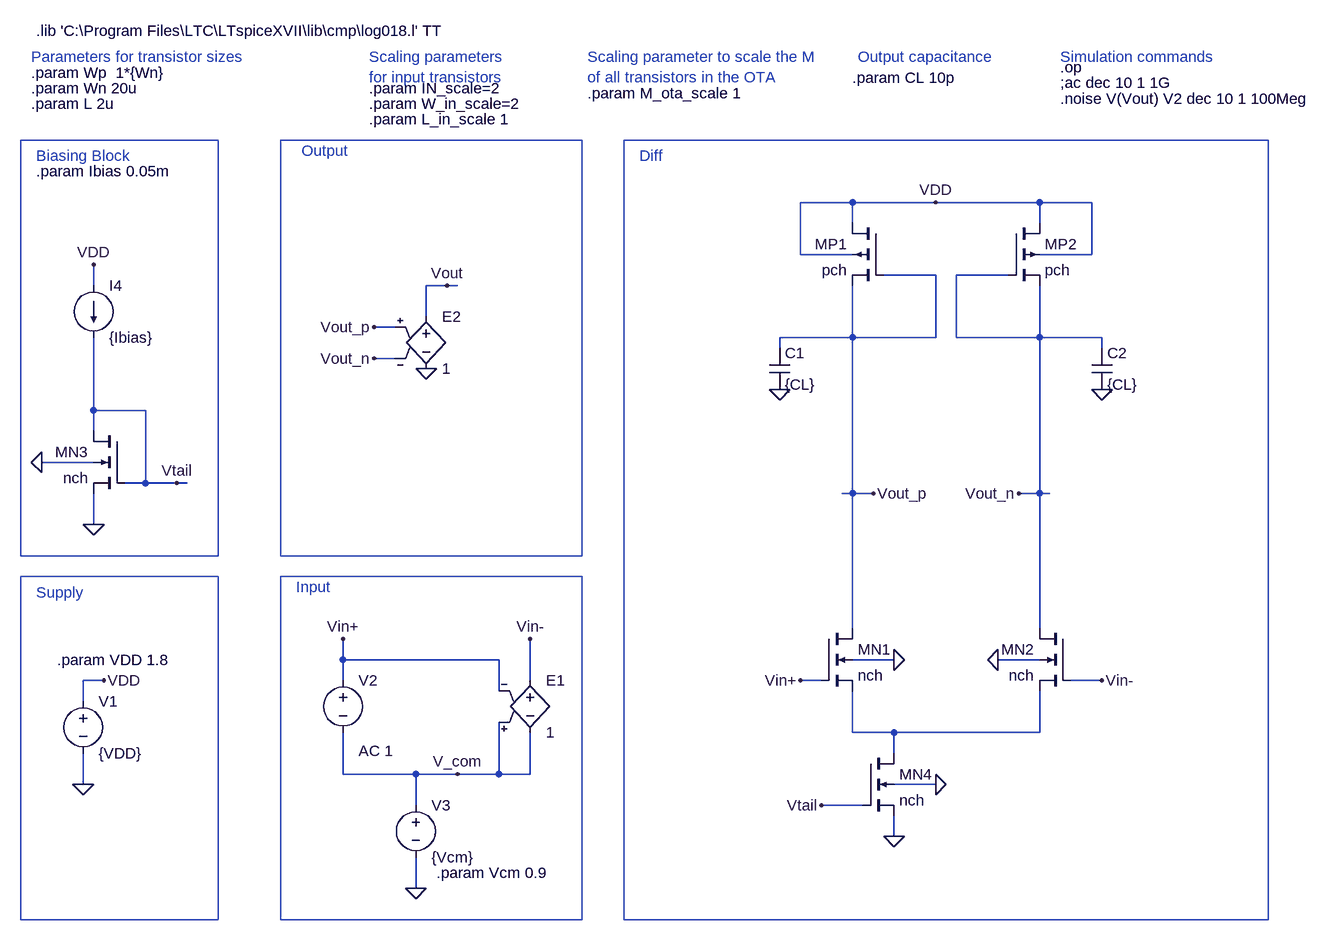
[diagram p0: schematic diff-amp.asc]
diff-amp.asc, the LTspice schematic file:
Version 4
SHEET 1 2076 1732
WIRE 48 480 -32 480
WIRE 176 480 48 480
WIRE 336 480 176 480
WIRE 416 480 336 480
WIRE 48 512 48 480
WIRE 336 512 336 480
WIRE -32 560 -32 480
WIRE 48 560 -32 560
WIRE 416 560 416 480
WIRE 416 560 336 560
WIRE 176 592 96 592
WIRE 288 592 208 592
WIRE -1120 608 -1120 576
WIRE -576 608 -608 608
WIRE -560 608 -576 608
WIRE -608 656 -608 608
WIRE -656 672 -688 672
WIRE 48 688 48 608
WIRE 48 688 -64 688
WIRE 176 688 176 592
WIRE 176 688 48 688
WIRE 208 688 208 592
WIRE 336 688 336 608
WIRE 336 688 208 688
WIRE 432 688 336 688
WIRE -64 704 -64 688
WIRE 432 704 432 688
WIRE -656 720 -688 720
WIRE -1120 800 -1120 688
WIRE -1040 800 -1120 800
WIRE -1120 832 -1120 800
WIRE -1120 880 -1200 880
WIRE -1040 912 -1040 800
WIRE -1040 912 -1072 912
WIRE -992 912 -1040 912
WIRE -976 912 -992 912
WIRE 48 928 48 688
WIRE 48 928 32 928
WIRE 80 928 48 928
WIRE 336 928 336 688
WIRE 336 928 304 928
WIRE 352 928 336 928
WIRE -1120 976 -1120 928
WIRE 48 1136 48 928
WIRE 336 1136 336 928
WIRE -736 1184 -736 1152
WIRE -496 1184 -736 1184
WIRE 112 1184 48 1184
WIRE 336 1184 272 1184
WIRE -1104 1216 -1136 1216
WIRE -736 1216 -736 1184
WIRE -448 1216 -448 1152
WIRE 0 1216 -32 1216
WIRE 432 1216 384 1216
WIRE -496 1232 -496 1184
WIRE -1136 1248 -1136 1216
WIRE 48 1296 48 1232
WIRE 112 1296 48 1296
WIRE 336 1296 336 1232
WIRE 336 1296 112 1296
WIRE 112 1328 112 1296
WIRE -736 1360 -736 1296
WIRE -624 1360 -736 1360
WIRE -560 1360 -624 1360
WIRE -496 1360 -496 1280
WIRE -496 1360 -560 1360
WIRE -448 1360 -448 1296
WIRE -448 1360 -496 1360
WIRE -1136 1376 -1136 1328
WIRE 176 1376 112 1376
WIRE -624 1408 -624 1360
WIRE 64 1408 0 1408
WIRE 112 1456 112 1424
WIRE -624 1536 -624 1488
FLAG -1136 1376 0
FLAG 112 1184 0
FLAG 80 928 Vout_p
FLAG 272 1184 0
FLAG 304 928 Vout_n
FLAG 112 1456 0
FLAG -736 1152 Vin+
FLAG -448 1152 Vin-
FLAG -32 1216 Vin+
FLAG 432 1216 Vin-
FLAG -1104 1216 VDD
FLAG 176 480 VDD
FLAG -1120 576 VDD
FLAG -1200 880 0
FLAG -1120 976 0
FLAG 176 1376 0
FLAG -624 1536 0
FLAG -688 672 Vout_p
FLAG -688 720 Vout_n
FLAG -608 736 0
FLAG -576 608 Vout
FLAG 0 1408 Vtail
FLAG -992 912 Vtail
FLAG -560 1360 V_com
FLAG -64 768 0
FLAG 432 768 0
SYMBOL voltage -1136 1232 R0
WINDOW 123 0 0 Left 0
WINDOW 39 0 0 Left 0
SYMATTR InstName V1
SYMATTR Value {VDD}
SYMBOL voltage -736 1200 R0
WINDOW 123 24 124 Left 2
WINDOW 39 0 0 Left 0
SYMATTR Value2 AC 1
SYMATTR InstName V2
SYMATTR Value ""
SYMBOL nmos4 0 1136 R0
SYMATTR InstName MN1
SYMATTR Value nch
SYMATTR Value2 l={L*IN_scale*L_in_scale} w={Wn*IN_scale*W_in_scale}
SYMBOL nmos4 384 1136 M0
SYMATTR InstName MN2
SYMATTR Value nch
SYMATTR Value2 l={L*IN_scale*L_in_scale} w={Wn*IN_scale*W_in_scale}
SYMBOL current -1120 608 R0
WINDOW 123 0 0 Left 0
WINDOW 39 0 0 Left 0
SYMATTR InstName I4
SYMATTR Value {Ibias}
SYMBOL nmos4 -1072 832 M0
SYMATTR InstName MN3
SYMATTR Value nch
SYMATTR Value2 l={L} w={Wn}
SYMBOL nmos4 64 1328 R0
SYMATTR InstName MN4
SYMATTR Value nch
SYMATTR Value2 l={L} w={Wn}
SYMBOL voltage -624 1392 R0
WINDOW 123 0 0 Left 0
WINDOW 39 0 0 Left 0
SYMATTR InstName V3
SYMATTR Value {Vcm}
SYMBOL e2 -448 1200 R0
SYMATTR InstName E1
SYMATTR Value 1
SYMBOL e -608 640 R0
SYMATTR InstName E2
SYMATTR Value 1
SYMBOL pmos4 96 512 M0
SYMATTR InstName MP1
SYMATTR Value pch
SYMATTR Value2 l={L} w={Wp}
SYMBOL pmos4 288 512 R0
SYMATTR InstName MP2
SYMATTR Value pch
SYMATTR Value2 l={L} w={Wp}
SYMBOL cap -80 704 R0
SYMATTR InstName C1
SYMATTR Value {CL}
SYMBOL cap 416 704 R0
SYMATTR InstName C2
SYMATTR Value {CL}
TEXT -1208 216 Left 2 !.lib 'C:\\Program Files\\LTC\\LTspiceXVII\\lib\\cmp\\log018.l' TT
TEXT 368 272 Left 2 !.op
TEXT -1176 1184 Left 2 !.param VDD 1.8
TEXT 368 296 Left 2 !;ac dec 10 1 1G
TEXT 368 320 Left 2 !.noise V(Vout) V2 dec 10 1 100Meg
TEXT -1216 328 Left 2 !.param L 2u
TEXT -1216 280 Left 2 !.param Wp  1*{Wn}
TEXT -1216 304 Left 2 !.param Wn 20u
TEXT -696 304 Left 2 !.param IN_scale=2
TEXT -1208 432 Left 2 !.param Ibias 0.05m
TEXT -360 312 Left 2 !.param M_ota_scale 1
TEXT -696 328 Left 2 !.param W_in_scale=2
TEXT -696 352 Left 2 !.param L_in_scale 1
TEXT -1208 408 Left 2 ;Biasing Block
TEXT -280 408 Left 2 ;Diff
TEXT -808 1072 Left 2 ;Input
TEXT -800 400 Left 2 ;Output
TEXT -1208 1080 Left 2 ;Supply
TEXT -1216 256 Left 2 ;Parameters for transistor sizes
TEXT -696 256 Left 2 ;Scaling parameters \nfor input transistors
TEXT -360 256 Left 2 ;Scaling parameter to scale the M \nof all transistors in the OTA
TEXT 368 256 Left 2 ;Simulation commands
TEXT -592 1512 Left 2 !.param Vcm 0.9
TEXT 56 256 Left 2 ;Output capacitance
TEXT 48 288 Left 2 !.param CL 10p
RECTANGLE Normal -928 1024 -1232 384
RECTANGLE Normal -1232 1056 -928 1584
RECTANGLE Normal -368 1584 -832 1056
RECTANGLE Normal 688 1584 -304 384
RECTANGLE Normal -368 1024 -832 384

The netlist it stands for:
* diff-amp.asc
V1 VDD 0 {VDD}
V2 Vin+ V_com AC 1
MN1 Vout_p Vin+ N001 0 nch l={L*IN_scale*L_in_scale} w={Wn*IN_scale*W_in_scale}
MN2 Vout_n Vin- N001 0 nch l={L*IN_scale*L_in_scale} w={Wn*IN_scale*W_in_scale}
I4 VDD Vtail {Ibias}
MN3 Vtail Vtail 0 0 nch l={L} w={Wn}
MN4 N001 Vtail 0 0 nch l={L} w={Wn}
V3 V_com 0 {Vcm}
E1 Vin- V_com V_com Vin+ 1
E2 Vout 0 Vout_p Vout_n 1
MP1 VDD Vout_p Vout_p VDD pch l={L} w={Wp}
MP2 VDD Vout_n Vout_n VDD pch l={L} w={Wp}
C1 Vout_p 0 {CL}
C2 Vout_n 0 {CL}
.model NMOS NMOS
.model PMOS PMOS
.lib standard.mos
.lib 'C:\Program Files\LTC\LTspiceXVII\lib\cmp\log018.l' TT
.op
.param VDD 1.8
;ac dec 10 1 1G
.noise V(Vout) V2 dec 10 1 100Meg
.param L 2u
.param Wp  1*{Wn}
.param Wn 20u
.param IN_scale=2
.param Ibias 0.05m
.param M_ota_scale 1
.param W_in_scale=2
.param L_in_scale 1
* Biasing Block
* Diff
* Input
* Output
* Supply
* Parameters for transistor sizes
* Scaling parameters
* for input transistors
* Scaling parameter to scale the M
* of all transistors in the OTA
* Simulation commands
.param Vcm 0.9
* Output capacitance
.param CL 10p
.backanno
.end